# EAGLE design SwitchPanel (EAGLE 7.1.0)
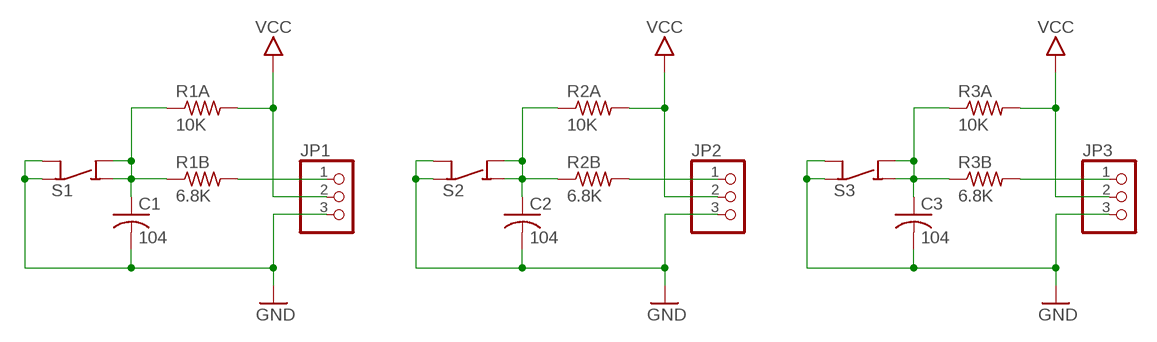
[diagram p0: schematic, sheet 1]

## Parts
C1  104  C-075PTH  [C075]
C2  104  C-075PTH  [C075]
C3  104  C-075PTH  [C075]
JP1  PINHD-1X03_2.54-90°-S  [1X03/90-S]
JP2  PINHD-1X03_2.54-90°-S  [1X03/90-S]
JP3  PINHD-1X03_2.54-90°-S  [1X03/90-S]
R1A  10K  R0207-PTH  [0207/7]
R1B  6.8K  R0207-PTH  [0207/7]
R2A  10K  R0207-PTH  [0207/7]
R2B  6.8K  R0207-PTH  [0207/7]
R3A  10K  R0207-PTH  [0207/7]
R3B  6.8K  R0207-PTH  [0207/7]
S1  SPST412MM  [12MMTACTILE_4PIN]
S2  SPST412MM  [12MMTACTILE_4PIN]
S3  SPST412MM  [12MMTACTILE_4PIN]

## Nets
GND: C1.2(-) C2.2(-) C3.2(-) JP1.3 JP2.3 JP3.3 S1.P1A(COM) S1.P1B(COM) S2.P1A(COM) S2.P1B(COM) S3.P1A(COM) S3.P1B(COM)
N$1: C2.1(+) R2A.1 R2B.1 S2.P2A(NO) S2.P2B(NO)
N$2: C1.1(+) R1A.1 R1B.1 S1.P2A(NO) S1.P2B(NO)
N$3: JP1.1 R1B.2
N$4: JP2.1 R2B.2
N$5: C3.1(+) R3A.1 R3B.1 S3.P2A(NO) S3.P2B(NO)
N$6: JP3.1 R3B.2
VCC: JP1.2 JP2.2 JP3.2 R1A.2 R2A.2 R3A.2

## Library data of the parts
C1-C3 = bt_rcl:C: Capacitor, non-polarized, American symbol
JP1-JP3 = pinhead-2:PINHD-1X03: PIN HEADER
R1A R1B R2A R2B R3A R3B = bt_rcl:R: Resistor, American symbol
S1-S3 = bt_electromech:SPST4: SPST switch with 2 pins per contact

## Board
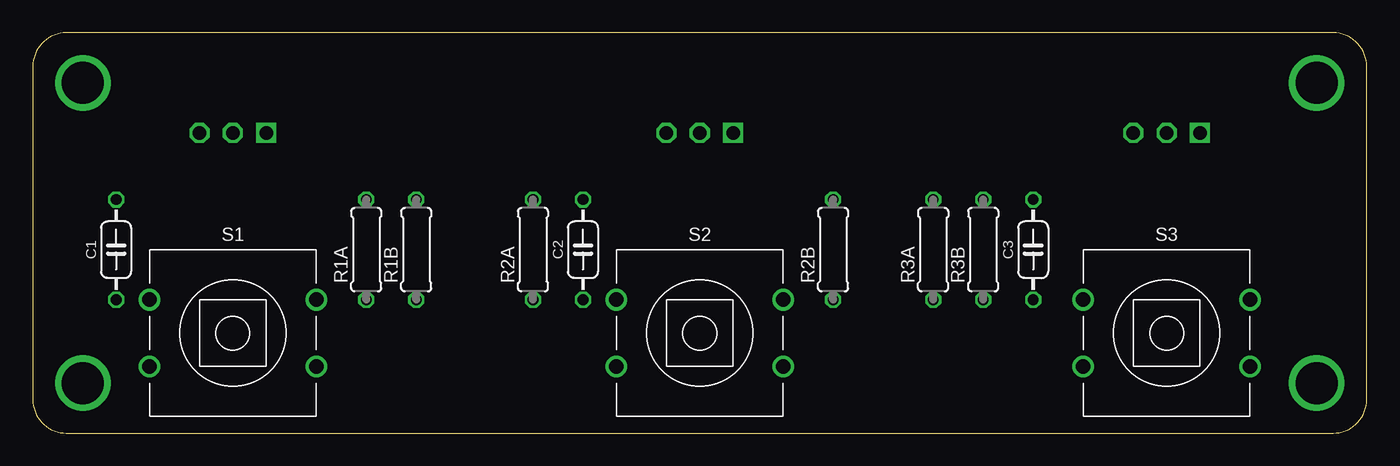
[diagram p1: board, top side]
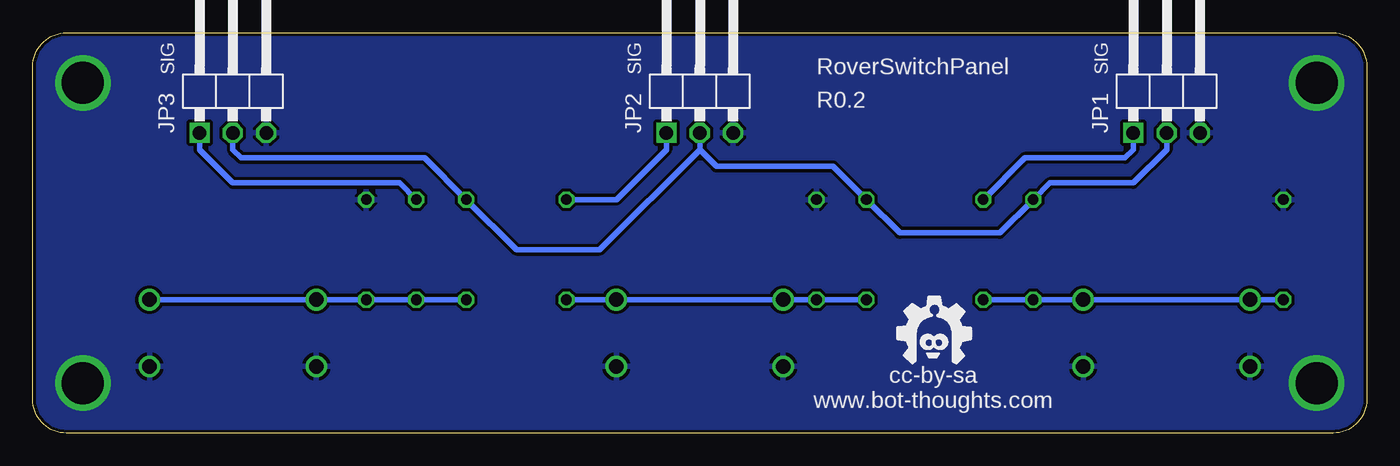
[diagram p2: board, bottom side, seen from below]

Size 101.6 x 30.48 mm. Coordinates in mm from the lower left corner, seen from the top.
Outline: 0,27.94 0,2.54 arc90 2.54,0 99.06,0 arc90 101.6,2.54 101.6,27.94 arc90 99.06,30.48 2.54,30.48 arc90 0,27.94
Copper layers (1*16): Top 0.0356mm / dielectric 1.5011mm / Bottom 0.0356mm
Design rules "LaenPCBOrder": minimum track width 6mil, minimum drill 13mil, track to track 10mil, track to pad 10mil, pad to pad 10mil, via to via 10mil, smd to smd 8mil, copper to edge 10mil, drill to drill 10mil, minimum pad ring 7mil, minimum via ring 7mil, stop-mask expansion 3mil, vias tented up to drill 20mil, thermal gap 10mil

### Footprints (pad centres in the part's own frame; a part is rotated, then mirrored left to right if it is on the bottom)
C075 = drill 0.813 octagon: 1 -3.81,0; 2 3.81,0
1X03/90-S = drill 1.016 square: 1 -2.54,-3.81 | drill 1.016 octagon: 2 0,-3.81; 3 2.54,-3.81
0207/7 = drill 0.813 octagon: 1 -3.81,0; 2 3.81,0
12MMTACTILE_4PIN = drill 1.1: P1A -6.35,-2.54; P1B 6.35,-2.54; P2A -6.35,2.54; P2B 6.35,2.54

### Placement (x,y rotation side)
C1  6.35,13.97 90 top
C2  41.91,13.97 90 top
C3  76.2,13.97 90 top
JP1  15.24,26.67 0 bottom
JP2  50.8,26.67 0 bottom
JP3  86.36,26.67 0 bottom
R1A  25.4,13.97 90 top
R1B  29.21,13.97 90 top
R2A  38.1,13.97 90 top
R2B  60.96,13.97 90 top
R3A  68.58,13.97 90 top
R3B  72.39,13.97 90 top
S1  15.24,7.62 0 top
S2  50.8,7.62 0 top
S3  86.36,7.62 0 top
U$4  [BTLOGOM]  33.02,5.08 0 bottom

### Tracks (layer width: path | path; a pad name or v marks a point on that pad's centre or on a via)
GND  (via drill 3.2)
  other vias: 3.81,26.67 3.81,3.81 97.79,26.67 97.79,3.81
  pour Bottom: 2.54,30.48 99.06,30.48 arc-90 101.6,27.94 101.6,2.54 arc-90 99.06,0 2.54,0 arc-90 0,2.54 0,27.94 arc-90
N$1
  Bottom 0.406: R2B.1 S2.P2B S2.P2A C2.1 R2A.1
N$2
  Bottom 0.406: C1.1 S1.P2A S1.P2B R1A.1 R1B.1
N$3
  Bottom 0.406: JP1.1 17.78,21.59 18.41,20.95 26.04,20.95 R1B.2
N$4
  Bottom 0.406: JP2.1 53.34,21.59 57.15,17.78 R2B.2
N$5
  Bottom 0.406: R3A.1 R3B.1 C3.1 S3.P2A S3.P2B
N$6
  Bottom 0.406: JP3.1 88.9,21.59 86.36,19.05 73.66,19.05 R3B.2
VCC
  Bottom 0.406: JP3.2 86.36,21.59 85.72,20.95 71.75,20.95 R3A.2 64.77,13.97 58.42,13.97 50.8,21.59 | JP2.2 50.8,21.59 | JP1.2 15.24,21.59 17.78,19.05 24.13,19.05 R1A.2 27.94,15.24 35.56,15.24 R2A.2 40.64,20.32 49.53,20.32 50.8,21.59

### Text on the board
bNames: SIG | RoverSwitchPanel | SIG | SIG | R0.2 | cc-by-sa | www.bot-thoughts.com